# EAGLE schematic BeagleBone_Blue (EAGLE 7.3.0)

## Sheet 1 of 4
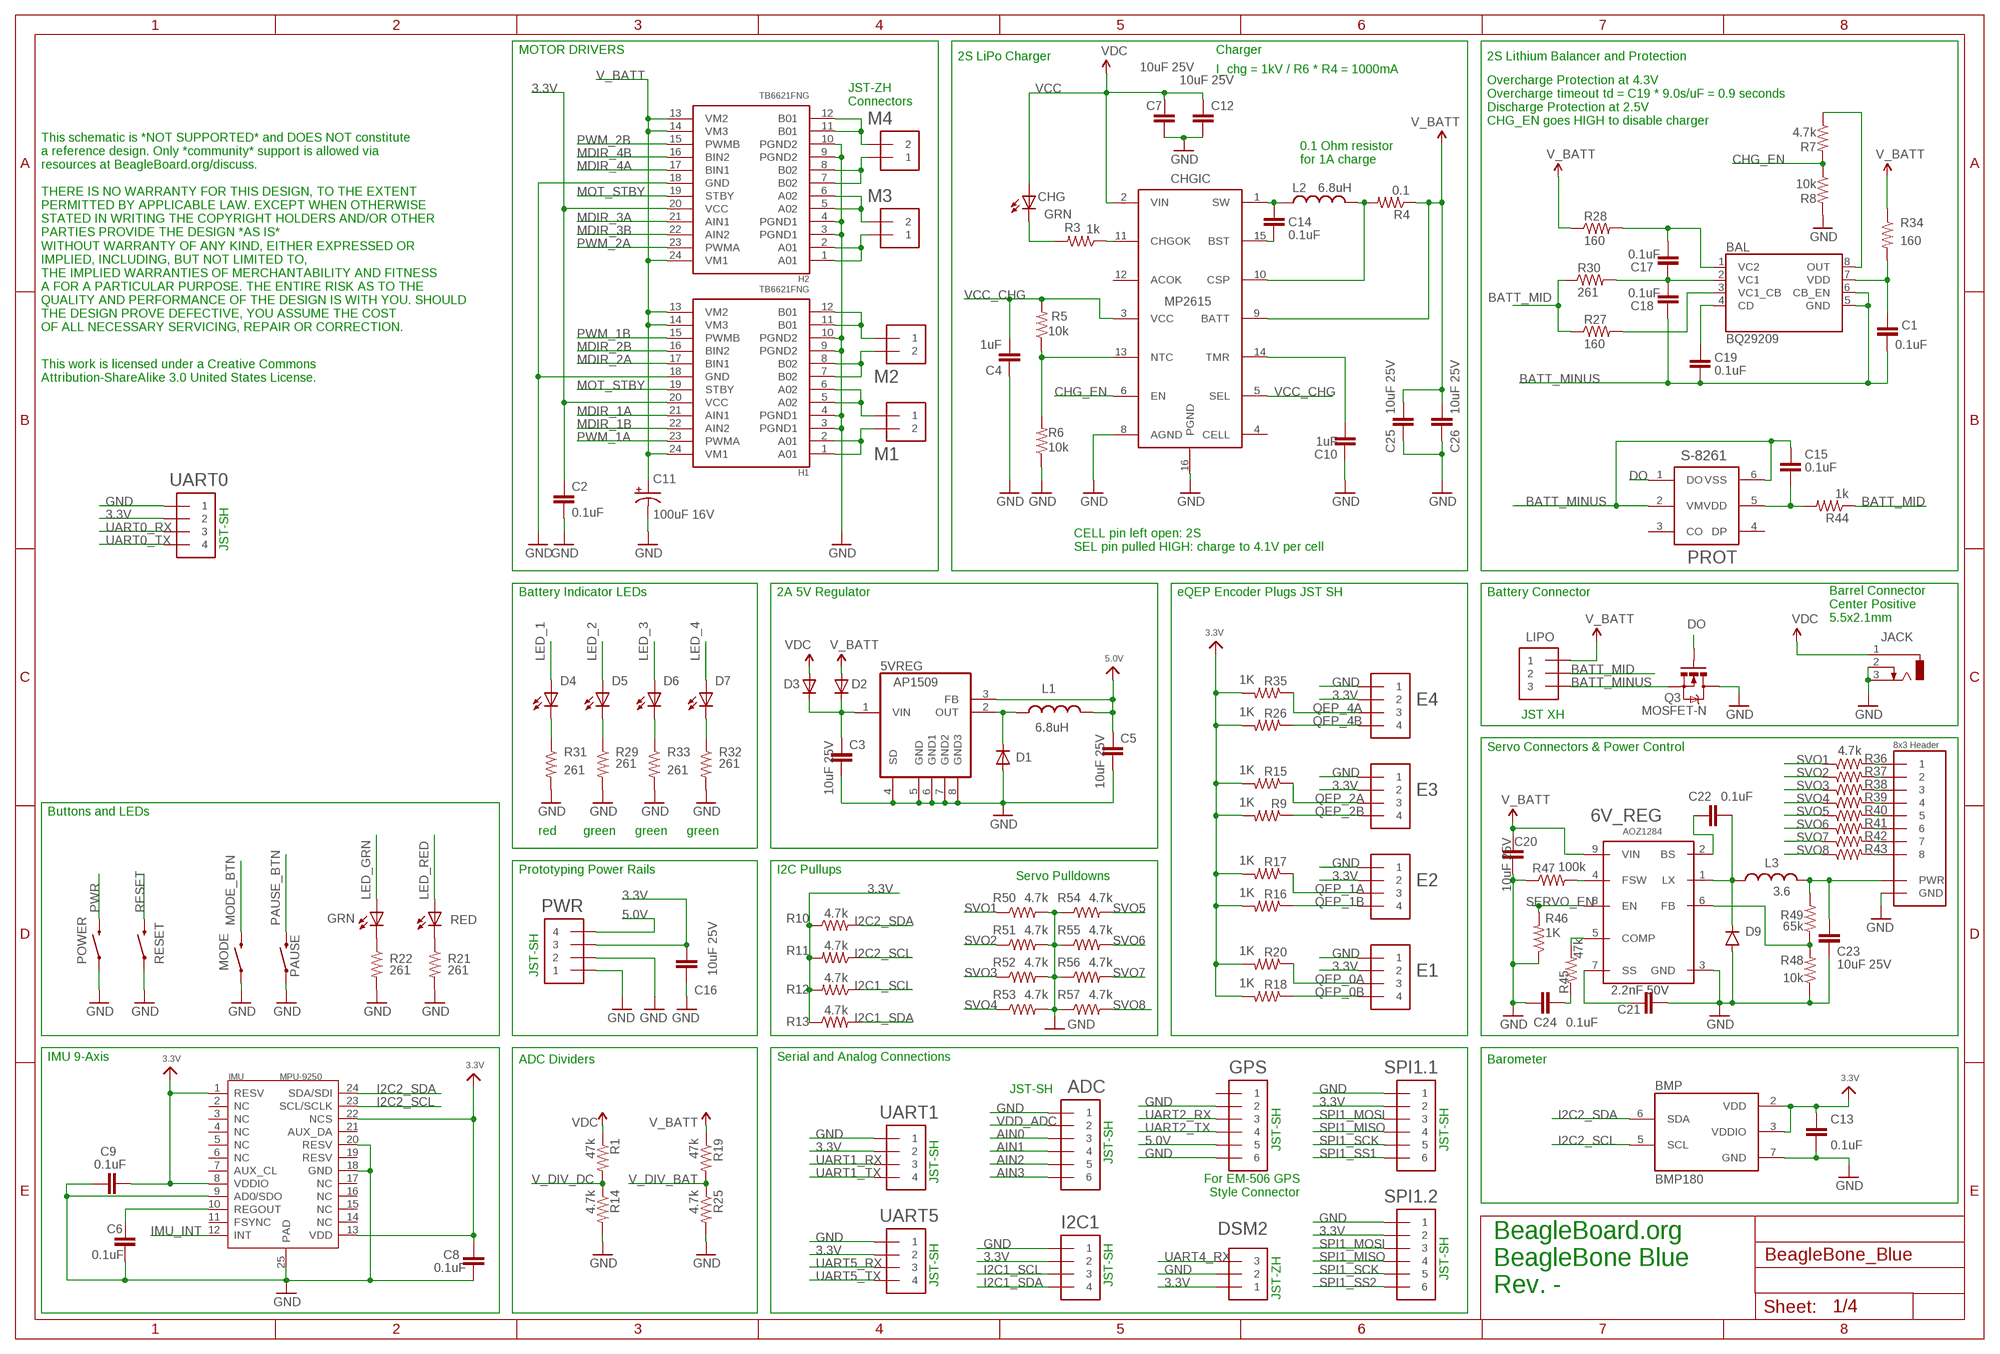
[diagram p0: schematic, sheet 1]

### Parts
5VREG  AP1509SOIC-8-TIGHT  [SO08-TIGHT]
6V_REG  AOZ1284  [SO08-EXPOSED]
ADC  JST_SH_6  [JST_SH_6]
BAL  BQ29209  [8-SON_3X3MM]
BMP  BMP180  [BMP180]
C1  0.1uF  CAP0402-CAP  [0402-CAP]
C2  0.1uF  CAP0402-CAP  [0402-CAP]
C3  10uF 25V  CAP0805  [0805]
C4  1uF  CAP0402-CAP  [0402-CAP]
C5  10uF 25V  CAP0805  [0805]
C6  0.1uF  CAP0402-CAP  [0402-CAP]
C7  10uF 25V  CAP0805  [0805]
C8  0.1uF  CAP0402-CAP  [0402-CAP]
C9  0.1uF  CAP0402-CAP  [0402-CAP]
C10  1uF  CAP0402-CAP  [0402-CAP]
C11  100uF 16V  CPOL-USD  [PANASONIC_D]
C12  10uF 25V  CAP0805  [0805]
C13  0.1uF  CAP0402-CAP  [0402-CAP]
C14  0.1uF  CAP0402-CAP  [0402-CAP]
C15  0.1uF  CAP0402-CAP  [0402-CAP]
C16  10uF 25V  CAP0805  [0805]
C17  0.1uF  CAP0402-CAP  [0402-CAP]
C18  0.1uF  CAP0402-CAP  [0402-CAP]
C19  0.1uF  CAP0402-CAP  [0402-CAP]
C20  10uF 25V  CAP0805  [0805]
C21  2.2nF 50V  CAP0402-CAP  [0402-CAP]
C22  0.1uF  CAP0402-CAP  [0402-CAP]
C23  10uF 25V  CAP0805  [0805]
C24  0.1uF  CAP0402-CAP  [0402-CAP]
C25  10uF 25V  CAP0805  [0805]
C26  10uF 25V  CAP0805  [0805]
CHG  GRN  LED0603  [LED-0603]
CHGIC  MP2615  [MP2615]
D1  DIODESOD-123  [SOD-123]
D2  DIODESOD-123  [SOD-123]
D3  DIODESOD-123  [SOD-123]
D4  RED  LED0603  [LED-0603]
D5  GREEN  LED0603  [LED-0603]
D6  GREEN  LED0603  [LED-0603]
D7  GREEN  LED0603  [LED-0603]
D9  DIODEDO214AA  [DO-214AA]
DSM2  JST_ZH_3SMD_TOP  [JST_ZH_3_SMD_TOP]
E1  JST_SH_4  [JST_SH_4_SMD]
E2  JST_SH_4  [JST_SH_4_SMD]
E3  JST_SH_4  [JST_SH_4_SMD]
E4  JST_SH_4  [JST_SH_4_SMD]
GPS  JST_SH_6  [JST_SH_6]
GRN  GRN  LED0603  [LED-0603]
H1  TB6621FNG  [SSOP24]
H2  TB6621FNG  [SSOP24]
I2C1  JST_SH_4  [JST_SH_4_SMD]
IMU  MPU-9250  [QFN24G-0.4-3X3MM]
JACK  5.5x2.1mm  DCJ0303  [DCJ0303]
L1  6.8uH  INDUCTORBOURNS_SRN6045  [SRN6045]
L2  6.8uH  INDUCTORBOURNS_SRN6045  [SRN6045]
L3  3.6  INDUCTOR  [8X8MM_INDUCTOR]
LIPO  JST_XH_3-PIN  [JST_XH_3-PIN]
M1  JST_ZH_2  [JST_ZH_2]
M2  JST_ZH_2  [JST_ZH_2]
M3  JST_ZH_2  [JST_ZH_2]
M4  JST_ZH_2  [JST_ZH_2]
MODE  SWITCH-MOMENTARY-2SMD-1101NE  [TACTILE-SWITCH-1101NE]
PAUSE  SWITCH-MOMENTARY-2SMD-1101NE  [TACTILE-SWITCH-1101NE]
POWER  SWITCH-MOMENTARY-2SMD-1101NE  [TACTILE-SWITCH-1101NE]
PROT  S-8261  [SOT-236]
PWR  JST_SH_4  [JST_SH_4_SMD]
Q3  MOSFET-N  MOSFET-NCHANNEL  [SO08-TIGHT]
R1  47k  RESISTOR0402-RES  [0402-RES]
R3  1k  RESISTOR0402-RES  [0402-RES]
R4  0.1  RESISTOR0603  [0603-RES]
R5  10k  RESISTOR0402-RES  [0402-RES]
R6  10k  RESISTOR0402-RES  [0402-RES]
R7  4.7k  RESISTOR0402-RES  [0402-RES]
R8  10k  RESISTOR0402-RES  [0402-RES]
R9  1K  RESISTOR0402-RES  [0402-RES]
R10  4.7k  RESISTOR0402-RES  [0402-RES]
R11  4.7k  RESISTOR0402-RES  [0402-RES]
R12  4.7k  RESISTOR0402-RES  [0402-RES]
R13  4.7k  RESISTOR0402-RES  [0402-RES]
R14  4.7k  RESISTOR0402-RES  [0402-RES]
R15  1K  RESISTOR0402-RES  [0402-RES]
R16  1K  RESISTOR0402-RES  [0402-RES]
R17  1K  RESISTOR0402-RES  [0402-RES]
R18  1K  RESISTOR0402-RES  [0402-RES]
R19  47k  RESISTOR0402-RES  [0402-RES]
R20  1K  RESISTOR0402-RES  [0402-RES]
R21  261  RESISTOR0402-RES  [0402-RES]
R22  261  RESISTOR0402-RES  [0402-RES]
R25  4.7k  RESISTOR0402-RES  [0402-RES]
R26  1K  RESISTOR0402-RES  [0402-RES]
R27  160  RESISTOR0402-RES  [0402-RES]
R28  160  RESISTOR0402-RES  [0402-RES]
R29  261  RESISTOR0402-RES  [0402-RES]
R30  261  RESISTOR0402-RES  [0402-RES]
R31  261  RESISTOR0402-RES  [0402-RES]
R32  261  RESISTOR0402-RES  [0402-RES]
R33  261  RESISTOR0402-RES  [0402-RES]
R34  160  RESISTOR0402-RES  [0402-RES]
R35  1K  RESISTOR0402-RES  [0402-RES]
R36  4.7k  RESISTOR0402-RES  [0402-RES]
R37  4.7k  RESISTOR0402-RES  [0402-RES]
R38  4.7k  RESISTOR0402-RES  [0402-RES]
R39  4.7k  RESISTOR0402-RES  [0402-RES]
R40  4.7k  RESISTOR0402-RES  [0402-RES]
R41  4.7k  RESISTOR0402-RES  [0402-RES]
R42  4.7k  RESISTOR0402-RES  [0402-RES]
R43  4.7k  RESISTOR0402-RES  [0402-RES]
R44  1k  RESISTOR0402-RES  [0402-RES]
R45  47k  RESISTOR0402-RES  [0402-RES]
R46  1K  RESISTOR0402-RES  [0402-RES]
R47  100k  RESISTOR0402-RES  [0402-RES]
R48  10k  RESISTOR0402-RES  [0402-RES]
R49  65k  RESISTOR0402-RES  [0402-RES]
R50  4.7k  RESISTOR0402-RES  [0402-RES]
R51  4.7k  RESISTOR0402-RES  [0402-RES]
R52  4.7k  RESISTOR0402-RES  [0402-RES]
R53  4.7k  RESISTOR0402-RES  [0402-RES]
R54  4.7k  RESISTOR0402-RES  [0402-RES]
R55  4.7k  RESISTOR0402-RES  [0402-RES]
R56  4.7k  RESISTOR0402-RES  [0402-RES]
R57  4.7k  RESISTOR0402-RES  [0402-RES]
RED  RED  LED0603  [LED-0603]
RESET  SWITCH-MOMENTARY-2SMD-1101NE  [TACTILE-SWITCH-1101NE]
SPI1.1  JST_SH_6  [JST_SH_6]
SPI1.2  JST_SH_6  [JST_SH_6]
U$1  SERVO_HEADERS_8X  [3X8_0.1"_HEADER]
UART0  JST_SH_4  [JST_SH_4_SMD]
UART1  JST_SH_4  [JST_SH_4_SMD]
UART5  JST_SH_4  [JST_SH_4_SMD]

### Nets
3.3V: BMP.2(VDD) BMP.3(VDDIO) C2.2 C8.1 C9.2 C13.1 C16.1 DSM2.1 E1.2 E2.2 E3.2 E4.2 H1.20(VCC) H2.20(VCC) I2C1.2 IMU.1(RESV) IMU.8(VDDIO) IMU.13(VDD) IMU.22(NCS) PWR.3 R9.2 R10.1 R11.2 R12.2 R13.1 R15.2 R16.2 R17.2 R18.2 R20.2 R26.2 R35.2 SPI1.1.2 SPI1.2.2 UART0.2 UART1.2 UART5.2
5.0V: 5VREG.3(FB) C5.1 GPS.5 L1.2 PWR.4 ; also sheet 2,3
AIN0: ADC.3 ; also sheet 3
AIN1: ADC.4 ; also sheet 3
AIN2: ADC.5 ; also sheet 3
AIN3: ADC.6 ; also sheet 3
BATT_MID: LIPO.P$2 R27.1 R30.1 R44.1
BATT_MINUS: BAL.5(GND) BAL.6(CB_EN) C1.2 C15.1 C18.1 C19.2 LIPO.P$3 PROT.2(VM) PROT.6(VSS) Q3.1(S) Q3.2(S) Q3.3(S)
CHG_EN: CHGIC.6(EN) R7.2 R8.1
CO: BAL.8(OUT) R7.1
DO: PROT.1(DO) Q3.4(G)
GND: 5VREG.4(SD) 5VREG.5(GND) 5VREG.6(GND1) 5VREG.7(GND2) 5VREG.8(GND3) 6V_REG.3(GND) ADC.1 BMP.7(GND) C2.1 C3.2 C4.1 C5.2 C6.2 C7.2 C8.2 C9.1 C10.1 C11.- C12.2 C13.2 C16.2 C20.1 C21.1 C23.1 C24.1 C25.2 C26.2 CHGIC.8(AGND) CHGIC.16(PGND) D1.A D9.A DSM2.2 E1.1 E2.1 E3.1 E4.1 GPS.2 GPS.6 H1.3(PGND1) H1.4(PGND1) H1.9(PGND2) H1.10(PGND2) H1.18(GND) H2.3(PGND1) H2.4(PGND1) H2.9(PGND2) H2.10(PGND2) H2.18(GND) I2C1.1 IMU.9(AD0/SDO) IMU.18(GND) IMU.20(RESV) IMU.25(PAD) JACK.2 JACK.3 MODE.1 PAUSE.1 POWER.1 PWR.1 PWR.2 Q3.5(D) Q3.6(D) Q3.7(D) Q3.8(D) R6.1 R8.2 R14.2 R21.2 R22.2 R25.2 R29.2 R31.2 R32.2 R33.2 R46.1 R47.1 R48.1 R50.2 R51.2 R52.2 R53.2 R54.1 R55.1 R56.1 R57.1 RESET.1 SPI1.1.1 SPI1.2.1 U$1.P$13(GND) U$1.P$14(GND) U$1.P$15(GND) U$1.P$16(GND) U$1.P$17(GND) U$1.P$18(GND) U$1.P$23(GND) U$1.P$24(GND) UART0.1 UART1.1 UART5.1 ; also sheet 2,3,4
I2C1_SCL: I2C1.3 R12.1 ; also sheet 2
I2C1_SDA: I2C1.4 R13.2 ; also sheet 2
I2C2_SCL: BMP.5(SCL) IMU.23(SCL/SCLK) R11.1 ; also sheet 2
I2C2_SDA: BMP.6(SDA) IMU.24(SDA/SDI) R10.2 ; also sheet 2
IMU_INT: IMU.12(INT) ; also sheet 2
L3: D6.C R33.1
L4: D7.C R32.1
LED_1: D4.A ; also sheet 2
LED_2: D5.A ; also sheet 3
LED_3: D6.A ; also sheet 2
LED_4: D7.A ; also sheet 2
LED_GRN: GRN.A ; also sheet 2
LED_RED: RED.A ; also sheet 2
MDIR_1A: H1.21(AIN1) ; also sheet 2
MDIR_1B: H1.22(AIN2) ; also sheet 2
MDIR_2A: H1.17(BIN1) ; also sheet 2
MDIR_2B: H1.16(BIN2) ; also sheet 3
MDIR_3A: H2.21(AIN1) ; also sheet 3
MDIR_3B: H2.22(AIN2) ; also sheet 3
MDIR_4A: H2.17(BIN1) ; also sheet 3
MDIR_4B: H2.16(BIN2) ; also sheet 3
MODE_BTN: MODE.2 ; also sheet 2
MOT1A: H1.1(A01) H1.2(A01) M1.P$2
MOT1B: H1.5(A02) H1.6(A02) M1.P$1
MOT2A: H1.11(B01) H1.12(B01) M2.P$1
MOT2B: H1.7(B02) H1.8(B02) M2.P$2
MOT3A: H2.1(A01) H2.2(A01) M3.P$1
MOT3B: H2.5(A02) H2.6(A02) M3.P$2
MOT4A: H2.11(B01) H2.12(B01) M4.P$2
MOT4B: H2.7(B02) H2.8(B02) M4.P$1
MOT_STBY: H1.19(STBY) H2.19(STBY) ; also sheet 2
N$1: R36.2 U$1.P$1
N$3: GRN.C R22.1
N$4: BAL.2(VC1) C17.1 C18.2 R30.2
N$6: R21.1 RED.C
N$8: BAL.1(VC2) C17.2 R28.2
N$10: 6V_REG.7(SS) C21.2
N$11: C15.2 PROT.5(VDD) R44.2
N$14: C6.1 IMU.10(REGOUT)
N$15: C14.1 CHGIC.15(BST)
N$16: 5VREG.2(OUT) D1.C L1.1
N$17: CHG.C R3.2
N$18: CHGIC.11(CHGOK) R3.1
N$24: BAL.4(CD) C19.1
N$25: R37.2 U$1.P$2
N$29: BAL.7(VDD) C1.1 R34.2
N$30: R38.2 U$1.P$3
N$38: R39.2 U$1.P$4
N$48: D5.C R29.1
N$49: D4.C R31.1
N$50: BAL.3(VC1_CB) R27.2
N$51: R40.2 U$1.P$5
N$52: R41.2 U$1.P$6
N$53: 6V_REG.2(BS) C22.1
N$54: R42.2 U$1.P$19
N$55: C14.2 CHGIC.1(SW) L2.1
N$56: R43.2 U$1.P$20
N$60: 6V_REG.1(LX) C22.2 D9.C L3.1
N$61: 6V_REG.4(FSW) R47.2
N$62: C23.2 L3.2 R49.2 U$1.P$7(PWR) U$1.P$8(PWR) U$1.P$9(PWR) U$1.P$10(PWR) U$1.P$11(PWR) U$1.P$12(PWR) U$1.P$21(PWR) U$1.P$22(PWR)
N$63: 6V_REG.5(COMP) R45.2
N$65: 6V_REG.6(FB) R48.2 R49.1
N$66: C24.2 R45.1
N$67: CHGIC.10(CSP) L2.2 R4.2
N$69: C10.2 CHGIC.14(TMR)
N$71: CHGIC.13(NTC) R5.1 R6.2
N$79: 5VREG.1(VIN) C3.1 D2.C D3.C
PAUSE_BTN: PAUSE.2 ; also sheet 2
PWM_1A: H1.23(PWMA) ; also sheet 2
PWM_1B: H1.15(PWMB) ; also sheet 2
PWM_2A: H2.23(PWMA) ; also sheet 2
PWM_2B: H2.15(PWMB) ; also sheet 2
PWR: POWER.2 ; also sheet 2
QEP_0A: E1.3 R20.1 ; also sheet 2
QEP_0B: E1.4 R18.1 ; also sheet 2
QEP_1A: E2.3 R17.1 ; also sheet 3
QEP_1B: E2.4 R16.1 ; also sheet 3
QEP_2A: E3.3 R15.1 ; also sheet 2
QEP_2B: E3.4 R9.1 ; also sheet 2
QEP_4A: E4.3 R35.1 ; also sheet 2
QEP_4B: E4.4 R26.1 ; also sheet 2
RESET: RESET.2 ; also sheet 2
SERVO_EN: 6V_REG.8(EN) R46.2 ; also sheet 3
SPI1_MISO: SPI1.1.4 SPI1.2.4 ; also sheet 2
SPI1_MOSI: SPI1.1.3 SPI1.2.3 ; also sheet 2
SPI1_SCK: SPI1.1.5 SPI1.2.5 ; also sheet 2
SPI1_SS1: SPI1.1.6 ; also sheet 2
SPI1_SS2: SPI1.2.6 ; also sheet 2
SVO1: R36.1 R50.1 ; also sheet 3
SVO2: R37.1 R51.1 ; also sheet 3
SVO3: R38.1 R52.1 ; also sheet 3
SVO4: R39.1 R53.1 ; also sheet 3
SVO5: R40.1 R54.2 ; also sheet 3
SVO6: R41.1 R55.2 ; also sheet 3
SVO7: R42.1 R56.2 ; also sheet 3
SVO8: R43.1 R57.2 ; also sheet 3
UART0_RX: UART0.3 ; also sheet 2
UART0_TX: UART0.4 ; also sheet 2
UART1_RX: UART1.3 ; also sheet 2
UART1_TX: UART1.4 ; also sheet 2
UART2_RX: GPS.3 ; also sheet 2
UART2_TX: GPS.4 ; also sheet 2
UART4_RX: DSM2.3 ; also sheet 2
UART5_RX: UART5.3 ; also sheet 3
UART5_TX: UART5.4 ; also sheet 3
V_BATT: 6V_REG.9(VIN) C11.+ C20.2 C25.1 C26.1 CHGIC.9(BATT) D2.A H1.13(VM2) H1.14(VM3) H1.24(VM1) H2.13(VM2) H2.14(VM3) H2.24(VM1) LIPO.P$1 R4.1 R19.1 R28.1 R34.1
V_DIV_BAT: R19.2 R25.1 ; also sheet 3
V_DIV_DC: R1.2 R14.1 ; also sheet 3
VCC: C7.1 C12.1 CHG.A CHGIC.2(VIN) D3.A JACK.1 R1.1 ; supply symbol labelled VDC
VCC_CHG: C4.2 CHGIC.3(VCC) CHGIC.5(SEL) R5.2
VDD_ADC: ADC.2 ; also sheet 3,4
Unconnected: CHGIC.4(CELL) CHGIC.12(ACOK) GPS.1 IMU.2(NC) IMU.3(NC) IMU.4(NC) IMU.5(NC) IMU.6(NC) IMU.7(AUX_CL) IMU.11(FSYNC) IMU.14(NC) IMU.15(NC) IMU.16(NC) IMU.17(NC) IMU.19(RESV) IMU.21(AUX_DA) PROT.3(CO) PROT.4(DP)

### Notes on the sheet
- MOTOR DRIVERS | Charger
- 2S LiPo Charger | 2S Lithium Balancer and Protection
- I_chg = 1kV / R6 * R4 = 1000mA
- JST-ZH
  Connectors
- Overcharge Protection at 4.3V
  Overcharge timeout td = C19 * 9.0s/uF = 0.9 seconds
  Discharge Protection at 2.5V
  CHG_EN goes HIGH to disable charger
- 0.1 Ohm resistor
  for 1A charge
- This schematic is *NOT SUPPORTED* and DOES NOT constitute 
  a reference design. Only *community* support is allowed via 
  resources at BeagleBoard.org/discuss. 
  
  THERE IS NO WARRANTY FOR THIS DESIGN, TO THE EXTENT 
  PERMITTED BY APPLICABLE LAW. EXCEPT WHEN OTHERWISE 
  STATED IN WRITING THE COPYRIGHT HOLDERS AND/OR OTHER 
  PARTIES PROVIDE THE DESIGN *AS IS*
  WITHOUT WARRANTY OF ANY KIND, EITHER EXPRESSED OR 
  IMPLIED, INCLUDING, BUT NOT LIMITED TO, 
  THE IMPLIED WARRANTIES OF MERCHANTABILITY AND FITNESS 
  A FOR A PARTICULAR PURPOSE. THE ENTIRE RISK AS TO THE 
  QUALITY AND PERFORMANCE OF THE DESIGN IS WITH YOU. SHOULD 
  THE DESIGN PROVE DEFECTIVE, YOU ASSUME THE COST 
  OF ALL NECESSARY SERVICING, REPAIR OR CORRECTION.
- This work is licensed under a Creative Commons 
  Attribution-ShareAlike 3.0 United States License.
- JST-SH
- CELL pin left open: 2S
  SEL pin pulled HIGH: charge to 4.1V per cell
- Battery Indicator LEDs | 2A 5V Regulator | eQEP Encoder Plugs JST SH | Battery Connector
- Barrel Connector
  Center Positive
  5.5x2.1mm
- JST XH
- Servo Connectors & Power Control
- Buttons and LEDs
- red | green | green | green
- Prototyping Power Rails | I2C Pullups
- Servo Pulldowns
- JST-SH
- ADC Dividers | Barometer
- IMU 9-Axis | Serial and Analog Connections
- JST-SH
- JST-SH | JST-SH
- JST-SH
- JST-SH
- For EM-506 GPS
  Style Connector
- JST-SH
- JST-SH | JST-SH
- BeagleBoard.org
  BeagleBone Blue
  Rev. -
- JST-ZH

## Sheet 2 of 4
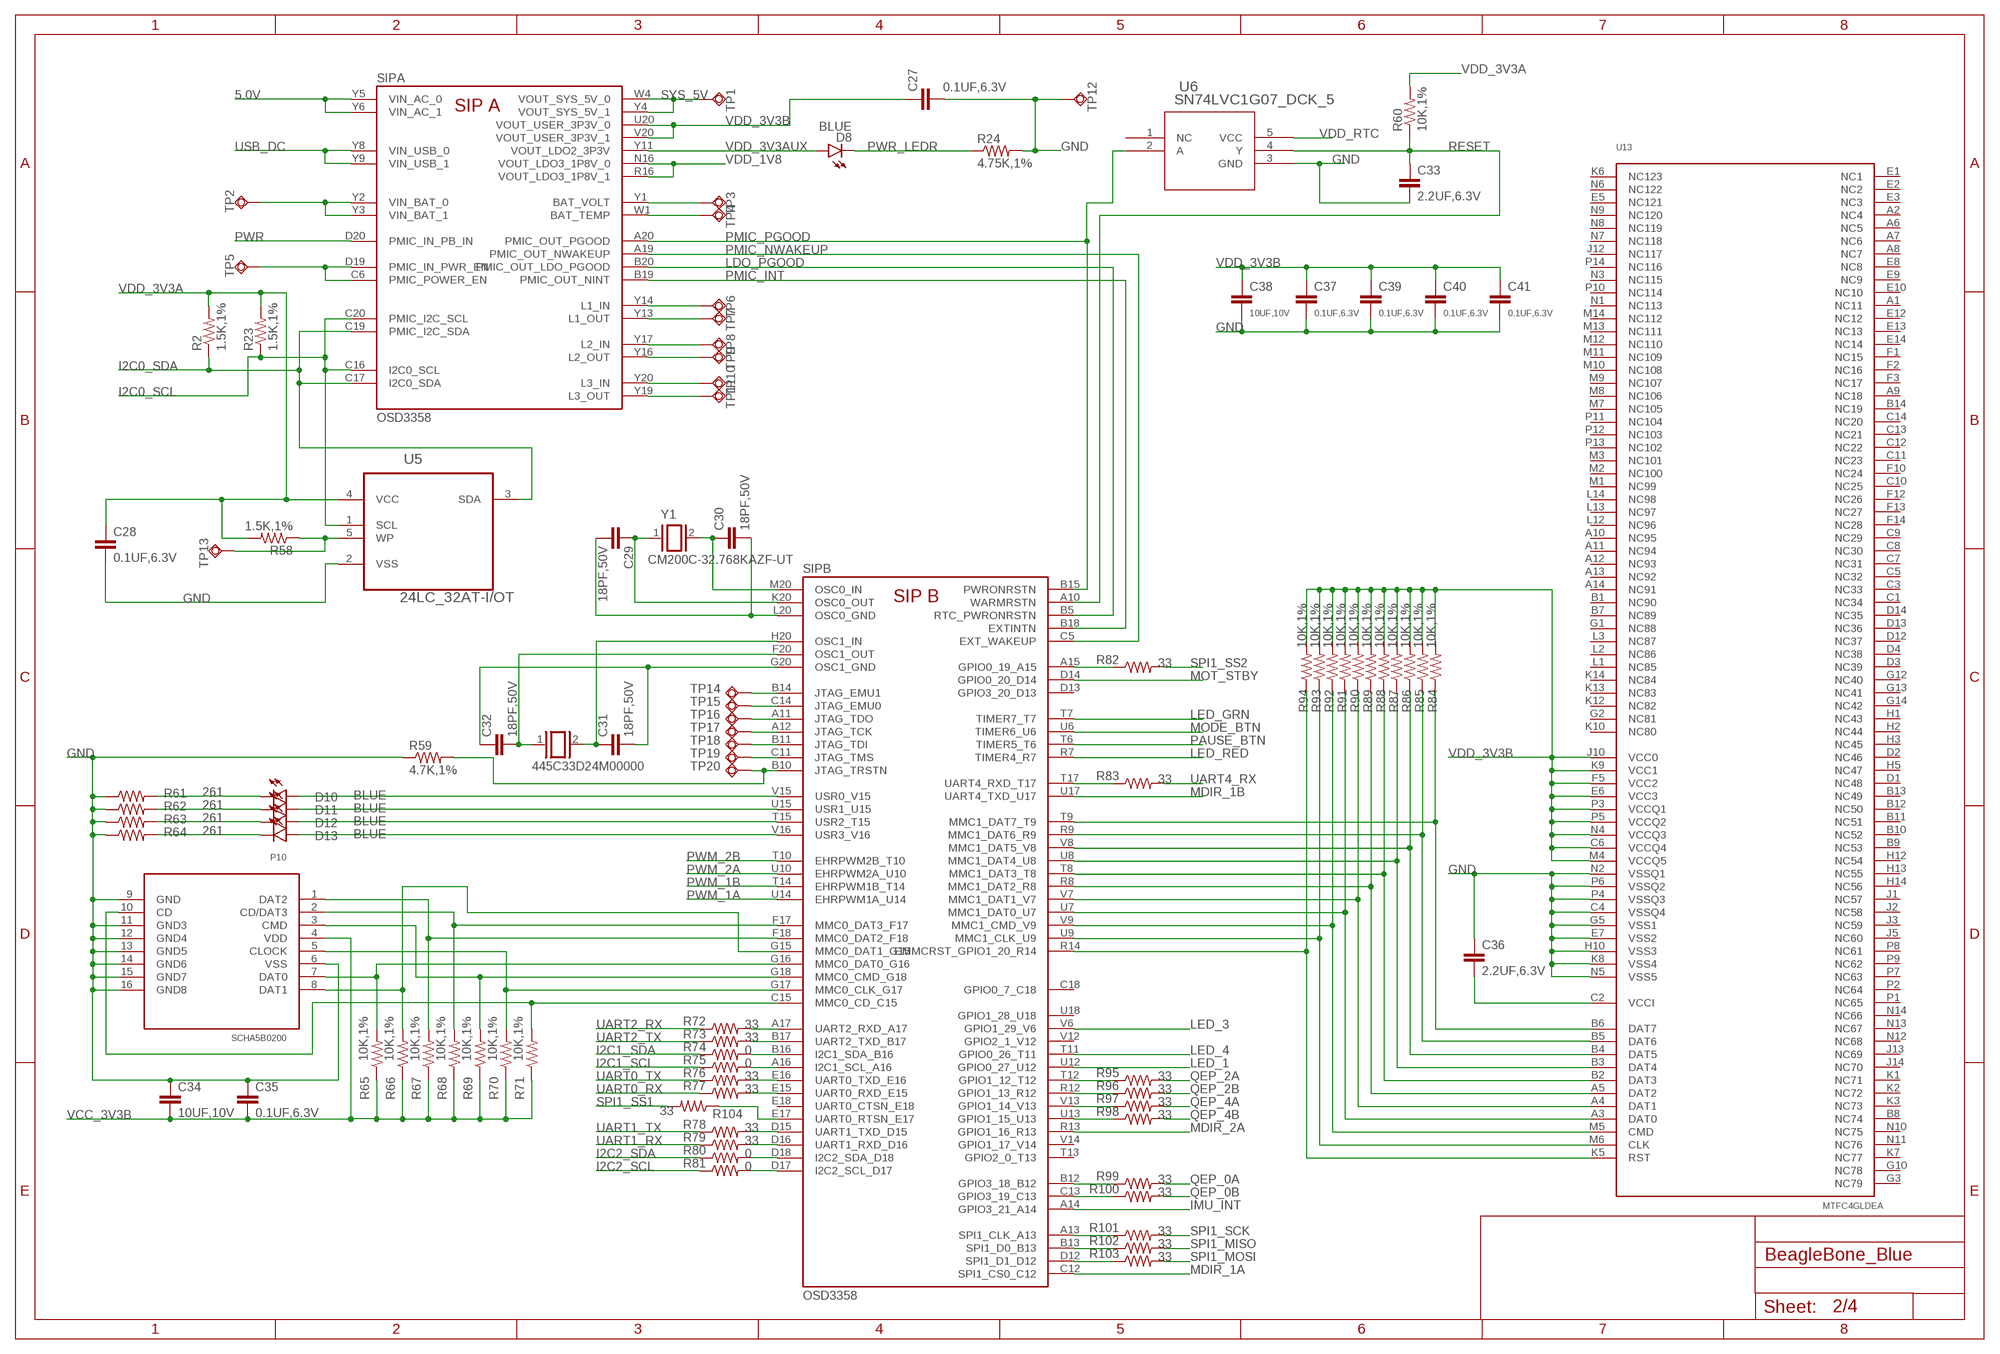
[diagram p1: schematic, sheet 2]

### Parts
C27  0.1UF,6.3V  CAP0402-CAP  [0402-CAP]
C28  0.1UF,6.3V  CAP0402-CAP  [0402-CAP]
C29  18PF,50V  CAP0402-CAP  [0402-CAP]
C30  18PF,50V  CAP0402-CAP  [0402-CAP]
C31  18PF,50V  CAP0402-CAP  [0402-CAP]
C32  18PF,50V  CAP0402-CAP  [0402-CAP]
C33  2.2UF,6.3V  CAP0402-CAP  [0402-CAP]
C34  10UF,10V  CAP0805  [0805]
C35  0.1UF,6.3V  CAP0402-CAP  [0402-CAP]
C36  2.2UF,6.3V  CAP0402-CAP  [0402-CAP]
C37  0.1UF,6.3V  CAP0402-CAP  [0402-CAP]
C38  10UF,10V  CAP0805  [0805]
C39  0.1UF,6.3V  CAP0402-CAP  [0402-CAP]
C40  0.1UF,6.3V  CAP0402-CAP  [0402-CAP]
C41  0.1UF,6.3V  CAP0402-CAP  [0402-CAP]
D8  BLUE  LED0603  [LED-0603]
D10  BLUE  LED0603  [LED-0603]
D11  BLUE  LED0603  [LED-0603]
D12  BLUE  LED0603  [LED-0603]
D13  BLUE  LED0603  [LED-0603]
P10  SCHA5B0200  [SCHA5B0200]
R2  1.5K,1%  RESISTOR0402-RES  [0402-RES]
R23  1.5K,1%  RESISTOR0402-RES  [0402-RES]
R24  4.75K,1%  RESISTOR0402-RES  [0402-RES]
R58  1.5K,1%  RESISTOR0402-RES  [0402-RES]
R59  4.7K,1%  RESISTOR0402-RES  [0402-RES]
R60  10K,1%  RESISTOR0402-RES  [0402-RES]
R61  261  RESISTOR0402-RES  [0402-RES]
R62  261  RESISTOR0402-RES  [0402-RES]
R63  261  RESISTOR0402-RES  [0402-RES]
R64  261  RESISTOR0402-RES  [0402-RES]
R65  10K,1%  RESISTOR0402-RES  [0402-RES]
R66  10K,1%  RESISTOR0402-RES  [0402-RES]
R67  10K,1%  RESISTOR0402-RES  [0402-RES]
R68  10K,1%  RESISTOR0402-RES  [0402-RES]
R69  10K,1%  RESISTOR0402-RES  [0402-RES]
R70  10K,1%  RESISTOR0402-RES  [0402-RES]
R71  10K,1%  RESISTOR0402-RES  [0402-RES]
R72  33  RESISTOR0402-RES  [0402-RES]
R73  33  RESISTOR0402-RES  [0402-RES]
R74  0  RESISTOR0402-RES  [0402-RES]
R75  0  RESISTOR0402-RES  [0402-RES]
R76  33  RESISTOR0402-RES  [0402-RES]
R77  33  RESISTOR0402-RES  [0402-RES]
R78  33  RESISTOR0402-RES  [0402-RES]
R79  33  RESISTOR0402-RES  [0402-RES]
R80  0  RESISTOR0402-RES  [0402-RES]
R81  0  RESISTOR0402-RES  [0402-RES]
R82  33  RESISTOR0402-RES  [0402-RES]
R83  33  RESISTOR0402-RES  [0402-RES]
R84  10K,1%  RESISTOR0402-RES  [0402-RES]
R85  10K,1%  RESISTOR0402-RES  [0402-RES]
R86  10K,1%  RESISTOR0402-RES  [0402-RES]
R87  10K,1%  RESISTOR0402-RES  [0402-RES]
R88  10K,1%  RESISTOR0402-RES  [0402-RES]
R89  10K,1%  RESISTOR0402-RES  [0402-RES]
R90  10K,1%  RESISTOR0402-RES  [0402-RES]
R91  10K,1%  RESISTOR0402-RES  [0402-RES]
R92  10K,1%  RESISTOR0402-RES  [0402-RES]
R93  10K,1%  RESISTOR0402-RES  [0402-RES]
R94  10K,1%  RESISTOR0402-RES  [0402-RES]
R95  33  RESISTOR0402-RES  [0402-RES]
R96  33  RESISTOR0402-RES  [0402-RES]
R97  33  RESISTOR0402-RES  [0402-RES]
R98  33  RESISTOR0402-RES  [0402-RES]
R99  33  RESISTOR0402-RES  [0402-RES]
R100  33  RESISTOR0402-RES  [0402-RES]
R101  33  RESISTOR0402-RES  [0402-RES]
R102  33  RESISTOR0402-RES  [0402-RES]
R103  33  RESISTOR0402-RES  [0402-RES]
R104  33  RESISTOR0402-RES  [0402-RES]
SIP  OSD3358  [OSD3358]
TP1  TPSQB1,27  [B1,27]
TP2  TPSQB1,27  [B1,27]
TP3  TPSQB1,27  [B1,27]
TP4  TPSQB1,27  [B1,27]
TP5  TPSQB1,27  [B1,27]
TP6  TPSQB1,27  [B1,27]
TP7  TPSQB1,27  [B1,27]
TP8  TPSQB1,27  [B1,27]
TP9  TPSQB1,27  [B1,27]
TP10  TPSQB1,27  [B1,27]
TP11  TPSQB1,27  [B1,27]
TP12  TPSQB1,27  [B1,27]
TP13  TPSQB1,27  [B1,27]
TP14  TPSQB1,27  [B1,27]
TP15  TPSQB1,27  [B1,27]
TP16  TPSQB1,27  [B1,27]
TP17  TPSQB1,27  [B1,27]
TP18  TPSQB1,27  [B1,27]
TP19  TPSQB1,27  [B1,27]
TP20  TPSQB1,27  [B1,27]
U5  24LC_32AT-I/OT  [SOT95P290X145-5N]
U6  SN74LVC1G07_DCK_5  [DCK5]
U8  MTFC4GLDEA  [MTFC4GLDEA]
Y1  CM200C-32.768KAZF-UT  [CM200C-32.768KAZF-UT]
Y2  445C33D24M00000  [445C33D24M00000]

### Nets
5.0V: SIP.Y5(A:VIN_AC_0) SIP.Y6(A:VIN_AC_1) ; also sheet 1,3
GND: C27.2 C28.2 C33.2 C34.1 C35.1 C36.1 C37.2 C38.2 C39.2 C40.2 C41.2 P10.6(VSS) P10.9(GND) P10.11(GND3) P10.12(GND4) P10.13(GND5) P10.14(GND6) P10.15(GND7) P10.16(GND8) R24.2 R59.1 R61.1 R62.1 R63.1 R64.1 TP12.TP U5.2(VSS) U6.3(GND) U8.C4(VSSQ4) U8.E7(VSS2) U8.G5(VSS1) U8.H10(VSS3) U8.K8(VSS4) U8.N2(VSSQ1) U8.N5(VSS5) U8.P4(VSSQ3) U8.P6(VSSQ2) ; also sheet 1,3,4
I2C0_SCL: R23.1 SIP.C16(A:I2C0_SCL) SIP.C20(A:PMIC_I2C_SCL) U5.1(SCL)
I2C0_SDA: R2.1 SIP.C17(A:I2C0_SDA) SIP.C19(A:PMIC_I2C_SDA) U5.3(SDA)
I2C1_SCL: R75.1 ; also sheet 1
I2C1_SDA: R74.1 ; also sheet 1
I2C2_SCL: R81.1 ; also sheet 1
I2C2_SDA: R80.1 ; also sheet 1
IMU_INT: SIP.A14(B:GPIO3_21_A14) ; also sheet 1
LDO_PGOOD: SIP.B5(B:RTC_PWRONRSTN) SIP.B20(A:PMIC_OUT_LDO_PGOOD)
LED_1: SIP.U12(B:GPIO0_27_U12) ; also sheet 1
LED_3: SIP.V6(B:GPIO1_29_V6) ; also sheet 1
LED_4: SIP.T11(B:GPIO0_26_T11) ; also sheet 1
LED_GRN: SIP.T7(B:TIMER7_T7) ; also sheet 1
LED_RED: SIP.R7(B:TIMER4_R7) ; also sheet 1
MDIR_1A: SIP.C12(B:SPI1_CS0_C12) ; also sheet 1
MDIR_1B: SIP.U17(B:UART4_TXD_U17) ; also sheet 1
MDIR_2A: SIP.R13(B:GPIO1_16_R13) ; also sheet 1
MODE_BTN: SIP.U6(B:TIMER6_U6) ; also sheet 1
MOT_STBY: SIP.D14(B:GPIO0_20_D14) ; also sheet 1
N$5: SIP.Y2(A:VIN_BAT_0) SIP.Y3(A:VIN_BAT_1) TP2.TP
N$7: SIP.Y1(A:BAT_VOLT) TP3.TP
N$9: SIP.W1(A:BAT_TEMP) TP4.TP
N$12: SIP.C6(A:PMIC_POWER_EN) SIP.D19(A:PMIC_IN_PWR_EN) TP5.TP
N$13: SIP.Y14(A:L1_IN) TP6.TP
N$19: SIP.Y13(A:L1_OUT) TP7.TP
N$20: SIP.Y17(A:L2_IN) TP8.TP
N$21: SIP.Y16(A:L2_OUT) TP9.TP
N$22: SIP.Y20(A:L3_IN) TP10.TP
N$23: SIP.Y19(A:L3_OUT) TP11.TP
N$26: C30.1 SIP.M20(B:OSC0_IN) Y1.2
N$27: C29.1 SIP.K20(B:OSC0_OUT) Y1.1
N$28: R58.1 TP13.TP U5.5(WP)
N$31: C29.2 C30.2 SIP.L20(B:OSC0_GND)
N$32: C31.1 SIP.H20(B:OSC1_IN) Y2.2
N$33: C32.2 SIP.F20(B:OSC1_OUT) Y2.1
N$34: C31.2 C32.1 SIP.G20(B:OSC1_GND)
N$35: SIP.B14(B:JTAG_EMU1) TP14.TP
N$36: SIP.C14(B:JTAG_EMU0) TP15.TP
N$37: SIP.A11(B:JTAG_TDO) TP16.TP
N$39: SIP.A12(B:JTAG_TCK) TP17.TP
N$40: SIP.B11(B:JTAG_TDI) TP18.TP
N$41: SIP.C11(B:JTAG_TMS) TP19.TP
N$42: R59.2 SIP.B10(B:JTAG_TRSTN) TP20.TP
N$43: D13.A SIP.V16(B:USR3_V16)
N$44: D12.A SIP.T15(B:USR2_T15)
N$45: D11.A SIP.U15(B:USR1_U15)
N$46: D10.A SIP.V15(B:USR0_V15)
N$47: D10.C R61.2
N$57: D11.C R62.2
N$58: D12.C R63.2
N$59: D13.C R64.2
N$64: P10.2(CD/DAT3) R68.2 SIP.F17(B:MMC0_DAT3_F17)
N$68: R72.2 SIP.A17(B:UART2_RXD_A17)
N$70: P10.8(DAT1) R66.2 SIP.G15(B:MMC0_DAT1_G15)
N$72: R73.2 SIP.B17(B:UART2_TXD_B17)
N$73: P10.5(CLOCK) R70.2 SIP.G17(B:MMC0_CLK_G17)
N$74: P10.3(CMD) R69.2 SIP.G18(B:MMC0_CMD_G18)
N$75: P10.10(CD) R71.2 SIP.C15(B:MMC0_CD_C15)
N$76: R74.2 SIP.B16(B:I2C1_SDA_B16)
N$77: P10.7(DAT0) R65.2 SIP.G16(B:MMC0_DAT0_G16)
N$78: R75.2 SIP.A16(B:I2C1_SCL_A16)
N$80: R76.2 SIP.E16(B:UART0_TXD_E16)
N$81: R77.2 SIP.E15(B:UART0_RXD_E15)
N$82: R78.2 SIP.D15(B:UART1_TXD_D15)
N$83: R79.2 SIP.D16(B:UART1_RXD_D16)
N$84: R80.2 SIP.D18(B:I2C2_SDA_D18)
N$85: R81.2 SIP.D17(B:I2C2_SCL_D17)
N$86: R82.1 SIP.A15(B:GPIO0_19_A15)
N$87: R83.1 SIP.T17(B:UART4_RXD_T17)
N$88: R84.1 SIP.T9(B:MMC1_DAT7_T9) U8.B6(DAT7)
N$89: R85.1 SIP.R9(B:MMC1_DAT6_R9) U8.B5(DAT6)
N$90: R86.1 SIP.V8(B:MMC1_DAT5_V8) U8.B4(DAT5)
N$91: R87.1 SIP.U8(B:MMC1_DAT4_U8) U8.B3(DAT4)
N$92: R88.1 SIP.T8(B:MMC1_DAT3_T8) U8.B2(DAT3)
N$93: R89.1 SIP.R8(B:MMC1_DAT2_R8) U8.A5(DAT2)
N$94: R90.1 SIP.V7(B:MMC1_DAT1_V7) U8.A4(DAT1)
N$95: R91.1 SIP.U7(B:MMC1_DAT0_U7) U8.A3(DAT0)
N$96: R92.1 SIP.V9(B:MMC1_CMD_V9) U8.M5(CMD)
N$97: R93.1 SIP.U9(B:MMC1_CLK_U9) U8.M6(CLK)
N$98: R94.1 SIP.R14(B:EMMCRST_GPIO1_20_R14) U8.K5(RST)
N$99: R95.1 SIP.T12(B:GPIO1_12_T12)
N$100: R96.1 SIP.R12(B:GPIO1_13_R12)
N$101: R97.1 SIP.V13(B:GPIO1_14_V13)
N$102: R98.1 SIP.U13(B:GPIO1_15_U13)
N$103: R99.1 SIP.B12(B:GPIO3_18_B12)
N$104: R100.1 SIP.C13(B:GPIO3_19_C13)
N$105: R101.1 SIP.A13(B:SPI1_CLK_A13)
N$106: R102.1 SIP.B13(B:SPI1_D0_B13)
N$107: R103.1 SIP.D12(B:SPI1_D1_D12)
N$108: R104.1 SIP.E17(B:UART0_RTSN_E17)
N$109: C36.2 U8.C2(VCCI)
NTE: P10.1(DAT2) R67.2 SIP.F18(B:MMC0_DAT2_F18)
PAUSE_BTN: SIP.T6(B:TIMER5_T6) ; also sheet 1
PMIC_INT: SIP.B18(B:EXTINTN) SIP.B19(A:PMIC_OUT_NINT)
PMIC_NWAKEUP: SIP.A19(A:PMIC_OUT_NWAKEUP) SIP.C5(B:EXT_WAKEUP)
PMIC_PGOOD: SIP.A20(A:PMIC_OUT_PGOOD) SIP.B15(B:PWRONRSTN) U6.2(A)
PWM_1A: SIP.U14(B:EHRPWM1A_U14) ; also sheet 1
PWM_1B: SIP.T14(B:EHRPWM1B_T14) ; also sheet 1
PWM_2A: SIP.U10(B:EHRPWM2A_U10) ; also sheet 1
PWM_2B: SIP.T10(B:EHRPWM2B_T10) ; also sheet 1
PWR: SIP.D20(A:PMIC_IN_PB_IN) ; also sheet 1
PWR_LEDR: D8.C R24.1
QEP_0A: R99.2 ; also sheet 1
QEP_0B: R100.2 ; also sheet 1
QEP_2A: R95.2 ; also sheet 1
QEP_2B: R96.2 ; also sheet 1
QEP_4A: R97.2 ; also sheet 1
QEP_4B: R98.2 ; also sheet 1
RESET: C33.1 R60.1 SIP.A10(B:WARMRSTN) U6.4(Y) ; also sheet 1
SPI1_MISO: R102.2 ; also sheet 1
SPI1_MOSI: R103.2 ; also sheet 1
SPI1_SCK: R101.2 ; also sheet 1
SPI1_SS1: R104.2 ; also sheet 1
SPI1_SS2: R82.2 ; also sheet 1
SYS_5V: SIP.W4(A:VOUT_SYS_5V_0) SIP.Y4(A:VOUT_SYS_5V_1) TP1.TP ; also sheet 3
UART0_RX: R77.1 ; also sheet 1
UART0_TX: R76.1 ; also sheet 1
UART1_RX: R79.1 ; also sheet 1
UART1_TX: R78.1 ; also sheet 1
UART2_RX: R72.1 ; also sheet 1
UART2_TX: R73.1 ; also sheet 1
UART4_RX: R83.2 ; also sheet 1
USB_DC: SIP.Y8(A:VIN_USB_0) SIP.Y9(A:VIN_USB_1) ; also sheet 3
VCC_3V3B: C34.2 C35.2 P10.4(VDD) R65.1 R66.1 R67.1 R68.1 R69.1 R70.1 R71.1
VDD_1V8: SIP.N16(A:VOUT_LDO3_1P8V_0) SIP.R16(A:VOUT_LDO3_1P8V_1) ; also sheet 4
VDD_3V3A: C28.1 R2.2 R23.2 R58.2 R60.2 U5.4(VCC) ; also sheet 3,4
VDD_3V3AUX: D8.A SIP.Y11(A:VOUT_LDO2_3P3V)
VDD_3V3B: C27.1 C37.1 C38.1 C39.1 C40.1 C41.1 R84.2 R85.2 R86.2 R87.2 R88.2 R89.2 R90.2 R91.2 R92.2 R93.2 R94.2 SIP.U20(A:VOUT_USER_3P3V_0) SIP.V20(A:VOUT_USER_3P3V_1) U8.C6(VCCQ4) U8.E6(VCC3) U8.F5(VCC2) U8.J10(VCC0) U8.K9(VCC1) U8.M4(VCCQ5) U8.N4(VCCQ3) U8.P3(VCCQ1) U8.P5(VCCQ2) ; also sheet 3
VDD_RTC: U6.5(VCC) ; also sheet 4
Unconnected: SIP.B1(D:NC4) SIP.B2(D:NC5) SIP.B3(D:NC6) SIP.C1(D:NC12) SIP.C2(D:NC20) SIP.C3(D:NC21) SIP.C4(D:NC22) SIP.C18(B:GPIO0_7_C18) SIP.D1(D:NC24) SIP.D2(D:NC31) SIP.D3(D:NC32) SIP.D4(D:NC33) SIP.D5(D:NC34) SIP.D13(B:GPIO3_20_D13) SIP.E1(D:NC46) SIP.E2(D:NC47) SIP.E3(D:NC48) SIP.E4(D:NC58) SIP.E18(B:UART0_CTSN_E18) SIP.F1(D:NC59) SIP.F2(D:NC60) SIP.F3(D:NC61) SIP.F4(D:NC68) SIP.G1(D:NC69) SIP.G2(D:NC70) SIP.G3(D:NC71) SIP.G4(D:NC76) SIP.H1(D:NC77) SIP.H2(D:NC78) SIP.H3(D:NC79) SIP.H4(D:NC84) SIP.J1(D:NC85) SIP.J2(D:NC86) SIP.J3(D:NC87) SIP.J4(D:NC94) SIP.K1(D:NC95) SIP.K2(D:NC96) SIP.K3(D:NC97) SIP.K4(D:NC104) SIP.L1(D:NC105) SIP.L2(D:NC106) SIP.L3(D:NC107) SIP.L4(D:NC111) SIP.M1(D:NC112) SIP.M2(D:NC113) SIP.M3(D:NC114) SIP.M4(D:NC121) SIP.N1(D:NC123) SIP.N2(D:NC124) SIP.N3(D:NC136) SIP.N4(D:NC137) SIP.P1(D:NC138) SIP.P2(D:NC23) SIP.P3(D:NC45) SIP.P4(D:NC122) SIP.T13(B:GPIO2_0_T13) SIP.U11(D:NC2) SIP.U18(B:GPIO1_28_U18) SIP.V10(D:NC3) SIP.V11(D:NC1) SIP.V12(B:GPIO2_1_V12) SIP.V14(B:GPIO1_17_V14) U6.1(NC) U8.A1(NC11) U8.A2(NC4) U8.A6(NC5) U8.A7(NC6) U8.A8(NC7) U8.A9(NC18) U8.A10(NC95) U8.A11(NC94) U8.A12(NC93) U8.A13(NC92) U8.A14(NC91) U8.B1(NC90) U8.B7(NC89) U8.B8(NC74) U8.B9(NC53) U8.B10(NC52) U8.B11(NC51) U8.B12(NC50) U8.B13(NC49) U8.B14(NC19) U8.C1(NC34) U8.C3(NC33) U8.C5(NC32) U8.C7(NC31) U8.C8(NC30) U8.C9(NC29) U8.C10(NC25) U8.C11(NC23) U8.C12(NC22) U8.C13(NC21) U8.C14(NC20) U8.D1(NC48) U8.D2(NC46) U8.D3(NC39) U8.D4(NC38) U8.D12(NC37) U8.D13(NC36) U8.D14(NC35) U8.E1(NC1) U8.E2(NC2) U8.E3(NC3) U8.E5(NC121) U8.E8(NC8) U8.E9(NC9) U8.E10(NC10) U8.E12(NC12) U8.E13(NC13) U8.E14(NC14) U8.F1(NC15) U8.F2(NC16) U8.F3(NC17) U8.F10(NC24) U8.F12(NC26) U8.F13(NC27) U8.F14(NC28) U8.G1(NC88) U8.G2(NC81) U8.G3(NC79) U8.G10(NC78) U8.G12(NC40) U8.G13(NC41) U8.G14(NC42) U8.H1(NC43) U8.H2(NC44) U8.H3(NC45) U8.H5(NC47) U8.H12(NC54) U8.H13(NC55) U8.H14(NC56) U8.J1(NC57) U8.J2(NC58) U8.J3(NC59) U8.J5(NC60) U8.J12(NC117) U8.J13(NC69) U8.J14(NC70) U8.K1(NC71) U8.K2(NC72) U8.K3(NC73) U8.K6(NC123) U8.K7(NC77) U8.K10(NC80) U8.K12(NC82) U8.K13(NC83) U8.K14(NC84) U8.L1(NC85) U8.L2(NC86) U8.L3(NC87) U8.L12(NC96) U8.L13(NC97) U8.L14(NC98) U8.M1(NC99) U8.M2(NC100) U8.M3(NC101) U8.M7(NC105) U8.M8(NC106) U8.M9(NC107) U8.M10(NC108) U8.M11(NC109) U8.M12(NC110) U8.M13(NC111) U8.M14(NC112) U8.N1(NC113) U8.N3(NC115) U8.N6(NC122) U8.N7(NC118) U8.N8(NC119) U8.N9(NC120) U8.N10(NC75) U8.N11(NC76) U8.N12(NC68) U8.N13(NC67) U8.N14(NC66) U8.P1(NC65) U8.P2(NC64) U8.P7(NC63) U8.P8(NC61) U8.P9(NC62) U8.P10(NC114) U8.P11(NC104) U8.P12(NC103) U8.P13(NC102) U8.P14(NC116)

## Sheet 3 of 4
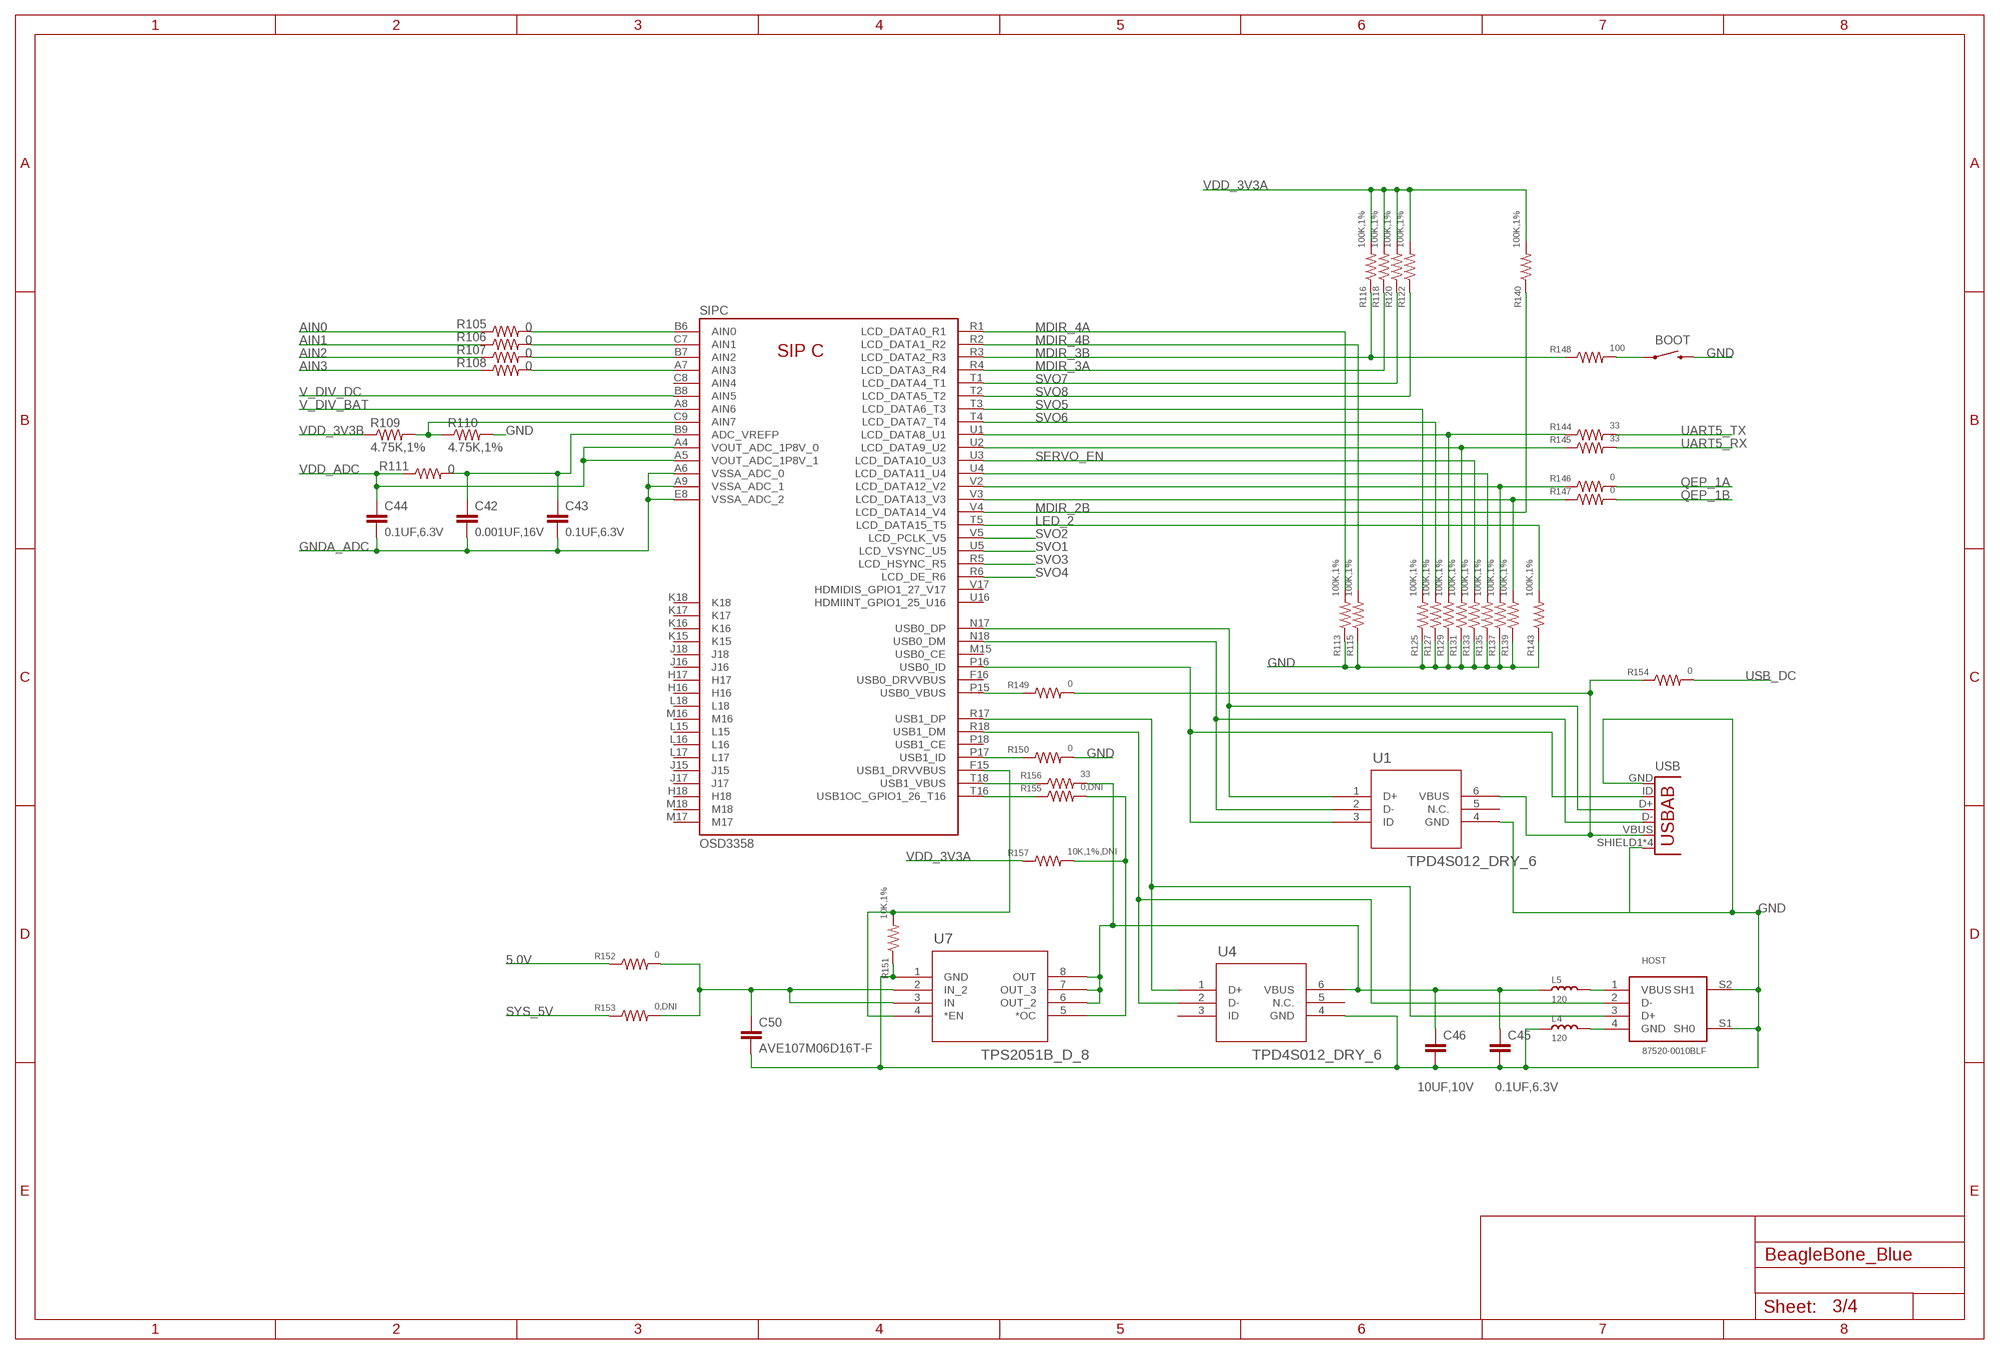
[diagram p2: schematic, sheet 3]

### Parts
BOOT  SWITCH-MOMENTARY-2SMD-1101NE  [TACTILE-SWITCH-1101NE]
C42  0.001UF,16V  CAP0402-CAP  [0402-CAP]
C43  0.1UF,6.3V  CAP0402-CAP  [0402-CAP]
C44  0.1UF,6.3V  CAP0402-CAP  [0402-CAP]
C45  0.1UF,6.3V  CAP0402-CAP  [0402-CAP]
C46  10UF,10V  CAP0805  [0805]
C50  AVE107M06D16T-F  [AVE107M06D16T-F]
HOST  87520-0010BLF  [87520-0010BLF]
L4  120  INDUCTOR/FERRITE-BEAD'0603'  [L0603]
L5  120  INDUCTOR/FERRITE-BEAD'0603'  [L0603]
R105  0  RESISTOR0402-RES  [0402-RES]
R106  0  RESISTOR0402-RES  [0402-RES]
R107  0  RESISTOR0402-RES  [0402-RES]
R108  0  RESISTOR0402-RES  [0402-RES]
R109  4.75K,1%  RESISTOR0402-RES  [0402-RES]
R110  4.75K,1%  RESISTOR0402-RES  [0402-RES]
R111  0  RESISTOR0402-RES  [0402-RES]
R113  100K,1%  RESISTOR0402-RES  [0402-RES]
R115  100K,1%  RESISTOR0402-RES  [0402-RES]
R116  100K,1%  RESISTOR0402-RES  [0402-RES]
R118  100K,1%  RESISTOR0402-RES  [0402-RES]
R120  100K,1%  RESISTOR0402-RES  [0402-RES]
R122  100K,1%  RESISTOR0402-RES  [0402-RES]
R125  100K,1%  RESISTOR0402-RES  [0402-RES]
R127  100K,1%  RESISTOR0402-RES  [0402-RES]
R129  100K,1%  RESISTOR0402-RES  [0402-RES]
R131  100K,1%  RESISTOR0402-RES  [0402-RES]
R133  100K,1%  RESISTOR0402-RES  [0402-RES]
R135  100K,1%  RESISTOR0402-RES  [0402-RES]
R137  100K,1%  RESISTOR0402-RES  [0402-RES]
R139  100K,1%  RESISTOR0402-RES  [0402-RES]
R140  100K,1%  RESISTOR0402-RES  [0402-RES]
R143  100K,1%  RESISTOR0402-RES  [0402-RES]
R144  33  RESISTOR0402-RES  [0402-RES]
R145  33  RESISTOR0402-RES  [0402-RES]
R146  0  RESISTOR0402-RES  [0402-RES]
R147  0  RESISTOR0402-RES  [0402-RES]
R148  100  RESISTOR0402-RES  [0402-RES]
R149  0  RESISTOR0402-RES  [0402-RES]
R150  0  RESISTOR0402-RES  [0402-RES]
R151  10K,1%  RESISTOR0402-RES  [0402-RES]
R152  0  RESISTOR0402-RES  [0402-RES]
R153  0,DNI  RESISTOR0402-RES  [0402-RES]
R154  0  RESISTOR0402-RES  [0402-RES]
R155  0,DNI  RESISTOR0402-RES  [0402-RES]
R156  33  RESISTOR0402-RES  [0402-RES]
R157  10K,1%,DNI  RESISTOR0402-RES  [0402-RES]
U1  TPD4S012_DRY_6  [DRY6]
U4  TPD4S012_DRY_6  [DRY6]
U7  TPS2051B_D_8  [D8]
USB  USB-AB  [USB-AB-MICRO-SMD]

### Nets
5.0V: R152.1 ; also sheet 1,2
AIN0: R105.1 ; also sheet 1
AIN1: R106.1 ; also sheet 1
AIN2: R107.1 ; also sheet 1
AIN3: R108.1 ; also sheet 1
GND: BOOT.2 C45.2 C46.2 C50.- HOST.S1(SH0) HOST.S2(SH1) L4.1 R110.2 R113.1 R115.1 R125.1 R127.1 R129.1 R131.1 R133.1 R135.1 R137.1 R139.1 R143.1 R150.2 R151.1 U1.4(GND) U4.4(GND) U7.1(GND) USB.GND USB.SHIELD1(SHIELD) USB.SHIELD2(SHIELD) USB.SHIELD3(SHIELD) USB.SHIELD4(SHIELD) ; also sheet 1,2,4
GNDA_ADC: C42.2 C43.2 C44.2 SIP.A6(C:VSSA_ADC_0) SIP.A9(C:VSSA_ADC_1) SIP.E8(C:VSSA_ADC_2)
LED_2: R143.2 SIP.T5(C:LCD_DATA15_T5) ; also sheet 1
MDIR_2B: R140.1 SIP.V4(C:LCD_DATA14_V4) ; also sheet 1
MDIR_3A: R118.1 SIP.R4(C:LCD_DATA3_R4) ; also sheet 1
MDIR_3B: R116.1 R148.1 SIP.R3(C:LCD_DATA2_R3) ; also sheet 1
MDIR_4A: R113.2 SIP.R1(C:LCD_DATA0_R1) ; also sheet 1
MDIR_4B: R115.2 SIP.R2(C:LCD_DATA1_R2) ; also sheet 1
N$2: R155.1 SIP.T16(C:USB1OC_GPIO1_26_T16)
N$110: C42.1 C43.1 R111.2 SIP.B9(C:ADC_VREFP)
N$111: R105.2 SIP.B6(C:AIN0)
N$112: R106.2 SIP.C7(C:AIN1)
N$113: R107.2 SIP.B7(C:AIN2)
N$114: R108.2 SIP.A7(C:AIN3)
N$115: R109.2 R110.1 SIP.C9(C:AIN7)
N$116: BOOT.1 R148.2
N$117: SIP.N17(C:USB0_DP) U1.1(D+) USB.D+
N$118: SIP.N18(C:USB0_DM) U1.2(D-) USB.D-
N$119: SIP.P16(C:USB0_ID) U1.3(ID) USB.ID(USBID)
N$120: R151.2 SIP.F15(C:USB1_DRVVBUS) U7.4(*EN)
N$121: R149.1 SIP.P15(C:USB0_VBUS)
N$122: C45.1 C46.1 L5.1 R156.2 U4.6(VBUS) U7.6(OUT_2) U7.7(OUT_3) U7.8(OUT)
N$123: HOST.3(D+) SIP.R17(C:USB1_DP) U4.1(D+)
N$124: HOST.2(D-) SIP.R18(C:USB1_DM) U4.2(D-)
N$125: R155.2 R157.2 U7.5(*OC)
N$126: R150.1 SIP.P17(C:USB1_ID)
N$127: C50.+ R152.2 R153.2 U7.2(IN_2) U7.3(IN)
N$128: HOST.4(GND) L4.2
N$129: R156.1 SIP.T18(C:USB1_VBUS)
N$130: HOST.1(VBUS) L5.2
N$141: R129.2 R144.1 SIP.U1(C:LCD_DATA8_U1)
N$144: R131.2 R145.1 SIP.U2(C:LCD_DATA9_U2)
N$150: R135.2 SIP.U4(C:LCD_DATA11_U4)
N$153: R137.2 R146.1 SIP.V2(C:LCD_DATA12_V2)
N$156: R139.2 R147.1 SIP.V3(C:LCD_DATA13_V3)
QEP_1A: R146.2 ; also sheet 1
QEP_1B: R147.2 ; also sheet 1
SERVO_EN: R133.2 SIP.U3(C:LCD_DATA10_U3) ; also sheet 1
SVO1: SIP.U5(C:LCD_VSYNC_U5) ; also sheet 1
SVO2: SIP.V5(C:LCD_PCLK_V5) ; also sheet 1
SVO3: SIP.R5(C:LCD_HSYNC_R5) ; also sheet 1
SVO4: SIP.R6(C:LCD_DE_R6) ; also sheet 1
SVO5: R125.2 SIP.T3(C:LCD_DATA6_T3) ; also sheet 1
SVO6: R127.2 SIP.T4(C:LCD_DATA7_T4) ; also sheet 1
SVO7: R120.1 SIP.T1(C:LCD_DATA4_T1) ; also sheet 1
SVO8: R122.1 SIP.T2(C:LCD_DATA5_T2) ; also sheet 1
SYS_5V: R153.1 ; also sheet 2
UART5_RX: R145.2 ; also sheet 1
UART5_TX: R144.2 ; also sheet 1
USB0_VBUS: R149.2 R154.1 U1.6(VBUS) USB.VBUS
USB_DC: R154.2 ; also sheet 2
V_DIV_BAT: SIP.A8(C:AIN6) ; also sheet 1
V_DIV_DC: SIP.B8(C:AIN5) ; also sheet 1
VDD_3V3A: R116.2 R118.2 R120.2 R122.2 R140.2 R157.1 ; also sheet 2,4
VDD_3V3B: R109.1 ; also sheet 2
VDD_ADC: C44.1 R111.1 SIP.A4(C:VOUT_ADC_1P8V_0) SIP.A5(C:VOUT_ADC_1P8V_1) ; also sheet 1,4
Unconnected: SIP.C8(C:AIN4) SIP.F16(C:USB0_DRVVBUS) SIP.H16(C:H16) SIP.H17(C:H17) SIP.H18(C:H18) SIP.J15(C:J15) SIP.J16(C:J16) SIP.J17(C:J17) SIP.J18(C:J18) SIP.K15(C:K15) SIP.K16(C:K16) SIP.K17(C:K17) SIP.K18(C:K18) SIP.L15(C:L15) SIP.L16(C:L16) SIP.L17(C:L17) SIP.L18(C:L18) SIP.M15(C:USB0_CE) SIP.M16(C:M16) SIP.M17(C:M17) SIP.M18(C:M18) SIP.P18(C:USB1_CE) SIP.U16(C:HDMIINT_GPIO1_25_U16) SIP.V17(C:HDMIDIS_GPIO1_27_V17) U1.5(N.C.) U4.3(ID) U4.5(N.C.)

## Sheet 4 of 4
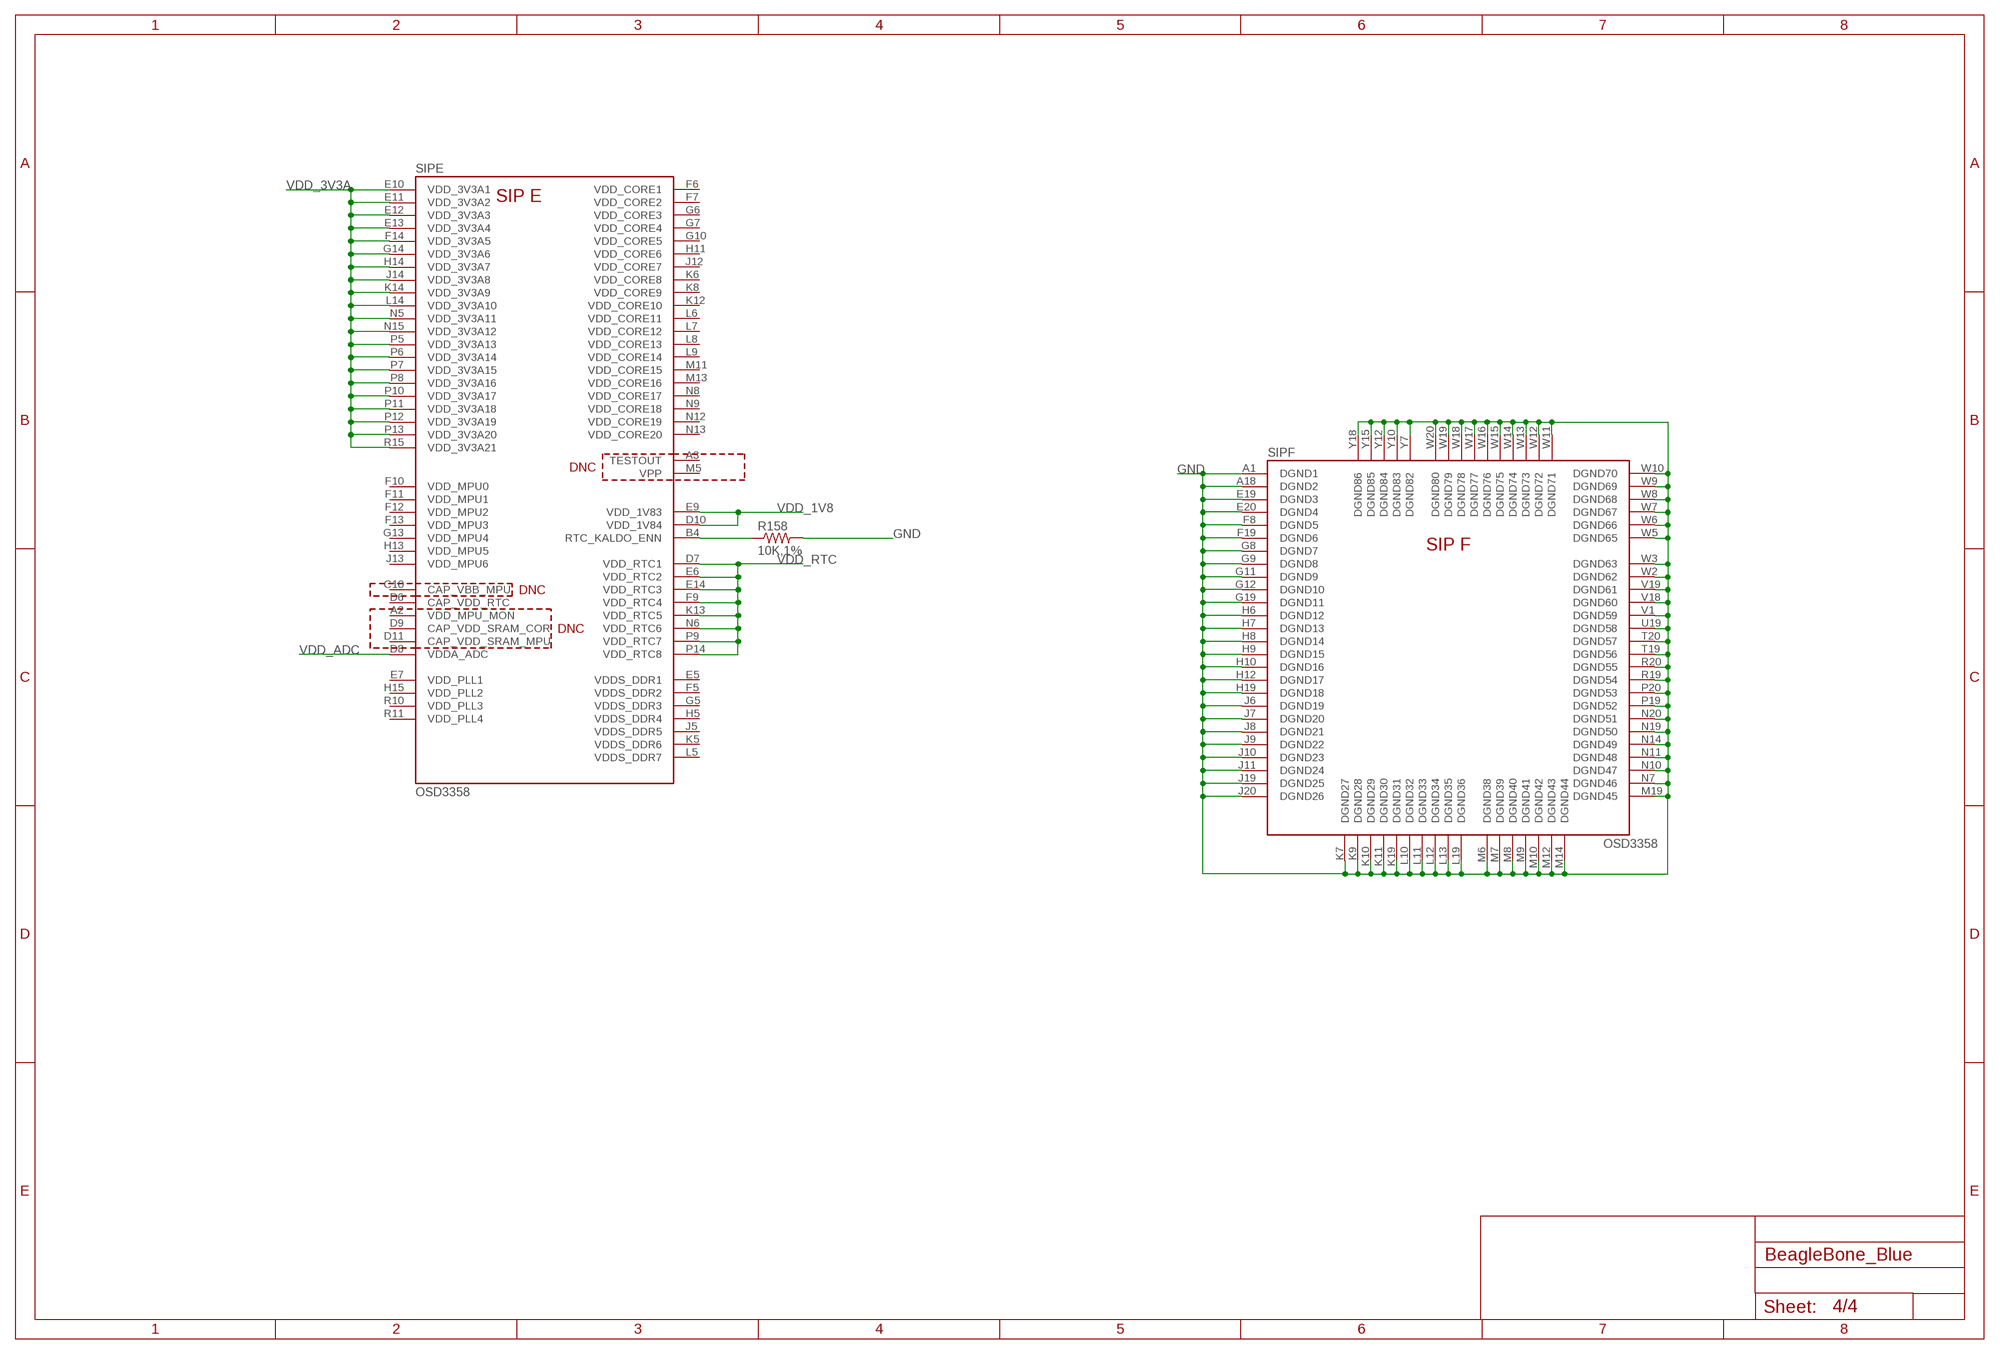
[diagram p3: schematic, sheet 4]

### Parts
R158  10K,1%  RESISTOR0402-RES  [0402-RES]

### Nets
GND: R158.2 SIP.A1(F:DGND1) SIP.A18(F:DGND2) SIP.E19(F:DGND3) SIP.E20(F:DGND4) SIP.F8(F:DGND5) SIP.F19(F:DGND6) SIP.G8(F:DGND7) SIP.G9(F:DGND8) SIP.G11(F:DGND9) SIP.G12(F:DGND10) SIP.G19(F:DGND11) SIP.H6(F:DGND12) SIP.H7(F:DGND13) SIP.H8(F:DGND14) SIP.H9(F:DGND15) SIP.H10(F:DGND16) SIP.H12(F:DGND17) SIP.H19(F:DGND18) SIP.J6(F:DGND19) SIP.J7(F:DGND20) SIP.J8(F:DGND21) SIP.J9(F:DGND22) SIP.J10(F:DGND23) SIP.J11(F:DGND24) SIP.J19(F:DGND25) SIP.J20(F:DGND26) SIP.K7(F:DGND27) SIP.K9(F:DGND28) SIP.K10(F:DGND29) SIP.K11(F:DGND30) SIP.K19(F:DGND31) SIP.L10(F:DGND32) SIP.L11(F:DGND33) SIP.L12(F:DGND34) SIP.L13(F:DGND35) SIP.L19(F:DGND36) SIP.M6(F:DGND38) SIP.M7(F:DGND39) SIP.M8(F:DGND40) SIP.M9(F:DGND41) SIP.M10(F:DGND42) SIP.M12(F:DGND43) SIP.M14(F:DGND44) SIP.M19(F:DGND45) SIP.N7(F:DGND46) SIP.N10(F:DGND47) SIP.N11(F:DGND48) SIP.N14(F:DGND49) SIP.N19(F:DGND50) SIP.N20(F:DGND51) SIP.P19(F:DGND52) SIP.P20(F:DGND53) SIP.R19(F:DGND54) SIP.R20(F:DGND55) SIP.T19(F:DGND56) SIP.T20(F:DGND57) SIP.U19(F:DGND58) SIP.V1(F:DGND59) SIP.V18(F:DGND60) SIP.V19(F:DGND61) SIP.W2(F:DGND62) SIP.W3(F:DGND63) SIP.W5(F:DGND65) SIP.W6(F:DGND66) SIP.W7(F:DGND67) SIP.W8(F:DGND68) SIP.W9(F:DGND69) SIP.W10(F:DGND70) SIP.W11(F:DGND71) SIP.W12(F:DGND72) SIP.W13(F:DGND73) SIP.W14(F:DGND74) SIP.W15(F:DGND75) SIP.W16(F:DGND76) SIP.W17(F:DGND77) SIP.W18(F:DGND78) SIP.W19(F:DGND79) SIP.W20(F:DGND80) SIP.Y7(F:DGND82) SIP.Y10(F:DGND83) SIP.Y12(F:DGND84) SIP.Y15(F:DGND85) SIP.Y18(F:DGND86) ; also sheet 1,2,3
N$131: R158.1 SIP.B4(E:RTC_KALDO_ENN)
VDD_1V8: SIP.D10(E:VDD_1V84) SIP.E9(E:VDD_1V83) ; also sheet 2
VDD_3V3A: SIP.E10(E:VDD_3V3A1) SIP.E11(E:VDD_3V3A2) SIP.E12(E:VDD_3V3A3) SIP.E13(E:VDD_3V3A4) SIP.F14(E:VDD_3V3A5) SIP.G14(E:VDD_3V3A6) SIP.H14(E:VDD_3V3A7) SIP.J14(E:VDD_3V3A8) SIP.K14(E:VDD_3V3A9) SIP.L14(E:VDD_3V3A10) SIP.N5(E:VDD_3V3A11) SIP.N15(E:VDD_3V3A12) SIP.P5(E:VDD_3V3A13) SIP.P6(E:VDD_3V3A14) SIP.P7(E:VDD_3V3A15) SIP.P8(E:VDD_3V3A16) SIP.P10(E:VDD_3V3A17) SIP.P11(E:VDD_3V3A18) SIP.P12(E:VDD_3V3A19) SIP.P13(E:VDD_3V3A20) SIP.R15(E:VDD_3V3A21) ; also sheet 2,3
VDD_ADC: SIP.D8(E:VDDA_ADC) ; also sheet 1,3
VDD_RTC: SIP.D7(E:VDD_RTC1) SIP.E6(E:VDD_RTC2) SIP.E14(E:VDD_RTC3) SIP.F9(E:VDD_RTC4) SIP.K13(E:VDD_RTC5) SIP.N6(E:VDD_RTC6) SIP.P9(E:VDD_RTC7) SIP.P14(E:VDD_RTC8) ; also sheet 2
Unconnected: SIP.A2(E:VDD_MPU_MON) SIP.A3(E:TESTOUT) SIP.C10(E:CAP_VBB_MPU) SIP.D6(E:CAP_VDD_RTC) SIP.D9(E:CAP_VDD_SRAM_COR) SIP.D11(E:CAP_VDD_SRAM_MPU) SIP.E5(E:VDDS_DDR1) SIP.E7(E:VDD_PLL1) SIP.F5(E:VDDS_DDR2) SIP.F6(E:VDD_CORE1) SIP.F7(E:VDD_CORE2) SIP.F10(E:VDD_MPU0) SIP.F11(E:VDD_MPU1) SIP.F12(E:VDD_MPU2) SIP.F13(E:VDD_MPU3) SIP.G5(E:VDDS_DDR3) SIP.G6(E:VDD_CORE3) SIP.G7(E:VDD_CORE4) SIP.G10(E:VDD_CORE5) SIP.G13(E:VDD_MPU4) SIP.H5(E:VDDS_DDR4) SIP.H11(E:VDD_CORE6) SIP.H13(E:VDD_MPU5) SIP.H15(E:VDD_PLL2) SIP.J5(E:VDDS_DDR5) SIP.J12(E:VDD_CORE7) SIP.J13(E:VDD_MPU6) SIP.K5(E:VDDS_DDR6) SIP.K6(E:VDD_CORE8) SIP.K8(E:VDD_CORE9) SIP.K12(E:VDD_CORE10) SIP.L5(E:VDDS_DDR7) SIP.L6(E:VDD_CORE11) SIP.L7(E:VDD_CORE12) SIP.L8(E:VDD_CORE13) SIP.L9(E:VDD_CORE14) SIP.M5(E:VPP) SIP.M11(E:VDD_CORE15) SIP.M13(E:VDD_CORE16) SIP.N8(E:VDD_CORE17) SIP.N9(E:VDD_CORE18) SIP.N12(E:VDD_CORE19) SIP.N13(E:VDD_CORE20) SIP.R10(E:VDD_PLL3) SIP.R11(E:VDD_PLL4)

## Library data of the parts
5VREG = BeagleBone_Blue:AP1509: 150KHz, 2A PWM BUCK DC/DC CONVERTER
6V_REG = Strawson_Eagle_Lib:AOZ1284
ADC GPS SPI1.1 SPI1.2 = Strawson_Eagle_Lib:JST_SH_6
BAL = Strawson_Eagle_Lib:BQ29209: BQ29209 2-CELL Balance and Overvoltage Protection
BMP = SparkFun-Sensors:BMP180: BOSCH BMP180 DIGITAL BAROMETRIC PRESSURE SENSOR Web page: http://www.bosch-sensortec.com/en/homepage/products_3/environmental_sensors_1/bmp180_1/bmp180 Datasheet: http://ae-bst.resource.bosch.com/media/products/dokumente/bmp180/BST-BMP180-DS000-09.pdf The BMP180 is the function compatible successor of the BMP085, a new generation of high precision digital pressure sensors for consumer applications. The ultra-low power, low voltage electronics of the BMP180 is optimized for use in mobile phones, PDAs, GPS navigation devices and outdoor equipment. With a low altitude noise of merely 0.25m at fast conversion time, the BMP180 offers superior performance. The I2C interface allows for easy system integration with a microcontroller. The BMP180 is based on piezo-resistive technology for EMC robustness, high accuracy and linearity as well as long term stability. Key features: - Temperature measurement included - I2C interface - Fully calibrated - Pb-free, halogen-free and RoHS compliant, - MSL 1 Basic specs: Pressure range: 300 to 1100hPa (+9000m to -500m relating to sea level) Supply voltage: 1.8 to 3.6V (VDD), 1.62V to 3.6V (VDDIO) Package: LGA package with metal lid Small footprint: 3.6mm x 3.8mm Super-flat: 0.93mm height Low power: 5μA at 1 sample / sec. in standard mode Low noise: 0.06hPa (0.5m) in ultra low power mode, 0.02hPa (0.17m) advanced resolution mode Typical applications: - Enhancement of GPS navigation (dead-reckoning, slope detection, etc.) - In- and out-door navigation - Leisure and sports - Weather forecast - Vertical velocity indication (rise/sink speed)
BOOT MODE PAUSE POWER RESET = SparkFun-Electromechanical:SWITCH-MOMENTARY-2: Various NO switches- pushbuttons, reed, etc; PROD_ID: SWCH-00815
C1 C2 C4 C6 C8-C10 C13-C15 C17-C19 C21 C22 C24 C27-C46 = Strawson_Eagle_Lib:CAP: Capacitor Standard 0603 ceramic capacitor, and 0.1" leaded capacitor.
C3 C5 C7 C12 C16 C20 C23 C25 C26 = SparkFun-Capacitors:CAP: Capacitor Standard 0603 ceramic capacitor, and 0.1" leaded capacitor.
C11 = adafruit:CPOL-US: POLARIZED CAPACITOR, American symbol
C50 = BeagleBone_Blue:AVE107M06D16T-F
CHG D4-D7 GRN RED = SparkFun-LED:LED: LEDs Standard schematic elements and footprints for 5mm, 3mm, 1206, and 0603 sized LEDs. 5mm - Spark Fun Electronics SKU : COM-00529 (and others)
CHGIC = Strawson_Eagle_Lib:MP2615
D1-D3 = adafruit:DIODE: Diode
D8 D10-D13 = BeagleBone_Blue:LED: LEDs Standard schematic elements and footprints for 5mm, 3mm, 1206, and 0603 sized LEDs. 5mm - Spark Fun Electronics SKU : COM-00529 (and others)
D9 = Strawson_Eagle_Lib:DIODE: Diode
DSM2 = Strawson_Eagle_Lib:JST_ZH_3
E1-E4 I2C1 PWR UART0 UART1 UART5 = Strawson_Eagle_Lib:JST_SH_4
H1 H2 = SparkFun:TB6621FNG: Toshiba 1A motor driver
HOST = BeagleBone_Blue:87520-0010BLF
IMU = Strawson_Eagle_Lib:MPU-9250: 314990005; MPN: MPU-9250
JACK = con-jack:DCJ0303: DC POWER JACK Source: DCJ0303.pdf; OC_FARNELL: unknown; OC_NEWARK: unknown
L1 L2 = SparkFun-Passives:INDUCTOR: Inductors; PROD_ID: NDUC-11627; VALUE: 33uH
L3 = Strawson_Eagle_Lib:INDUCTOR: Inductors; VALUE: 3.3uH
L4 L5 = Seeed-OPL-Inductor:INDUCTOR/FERRITE-BEAD
LIPO = Strawson_Eagle_Lib:JST_XH_3-PIN
M1-M4 = Strawson_Eagle_Lib:JST_ZH_2
P10 = SCHA5B0200:SCHA5B0200
PROT = Strawson_Eagle_Lib:S-8261
Q3 = Strawson_Eagle_Lib:MOSFET-NCHANNEL: Common NMOSFET Parts MFG P/N Store ID Prod ID FDD8780 TRANS-09984 SI7820DN TRANS-11055 FDS6630A IC-08089 2N7002PW TRANS-11151 FQP30N06L COM-10213 TRANS-10060 BSS123LT1G TRANS-08345 BSS138 TRANS-00830 BS170 2N7000
R1-R3 R5-R111 R113 R115 R116 R118 R120 R122 R125 R127 R129 R131 R133 R135 R137 R139 R140 R143-R158 = Strawson_Eagle_Lib:RESISTOR: Resistor Basic schematic elements and footprints for 0603, 1206, and PTH resistors.
R4 = SparkFun-Resistors:RESISTOR: Resistor Basic schematic elements and footprints for 0603, 1206, and PTH resistors.
SIP = BeagleBone_Blue:OSD3358: Octavo Systems LLC - OSD3358 Rev A
TP1-TP20 = testpad:TPSQ: Test pad
U1 U4 = BeagleBone_Blue:TPD4S012_DRY_6; DATASHEETURL: http://www.ti.com/lit/gpn/TPD4S012; DESCRIPTION: 4-Channel USB ESD Solution with Power Clamp; FAMILY_NAME: ESD Solution; GENERIC_PART_NUMBER: TPD4S012; INDUSTRY_STD_PKG_TYPE: SON; MANUFACTURER: Texas Instruments; MANUFACTURER_PART_NUMBER: tpd4s012_dry_6; PACKAGE_DESIGNATOR: DRY; PIN_COUNT: 6; VENDOR: Texas Instruments
U5 = Microchip-24LCxxx:24LC_: IC, I2C Serial EEPROM,SOT-23-5; MPN: 24LC32AT-I/OT; OC_FARNELL: 1700993; OC_NEWARK: 08P0113; PACKAGE: SOT-23-5; SUPPLIER: MICROCHIP
U6 = BeagleBone_Blue:SN74LVC1G07_DCK_5; DATASHEETURL: http://www.ti.com/lit/gpn/SN74LVC1G07; DESCRIPTION: Single Buffer/Driver With Open-Drain Output; FAMILY_NAME: LL BUFFER AND DRIVER WITH OPEN-DRAIN OUTPUT; GENERIC_PART_NUMBER: SN74LVC1G07; INDUSTRY_STD_PKG_TYPE: SC70; MANUFACTURER: Texas Instruments; MANUFACTURER_PART_NUMBER: sn74lvc1g07_dck_5; PACKAGE_DESIGNATOR: DCK; PIN_COUNT: 5; VENDOR: Texas Instruments
U7 = BeagleBone_Blue:TPS2051B_D_8; DATASHEETURL: http://www.ti.com/lit/gpn/TPS2051B; DESCRIPTION: Single, Current-Limited, Power-Distribution Switch; FAMILY_NAME: USB POWER SWITCH; GENERIC_PART_NUMBER: TPS2051B; INDUSTRY_STD_PKG_TYPE: SOIC; MANUFACTURER: Texas Instruments; MANUFACTURER_PART_NUMBER: tps2051b_d_8; PACKAGE_DESIGNATOR: D; PIN_COUNT: 8; VENDOR: Texas Instruments
U8 = BeagleBone_Blue:MTFC4GLDEA
U$1 = Strawson_Eagle_Lib:SERVO_HEADERS_8X
USB = Strawson_Eagle_Lib:USB-AB: This is a USB AB connector that is compatible with USB OTG. i.e. this connector can serve as a host or device
Y1 = CM200C-32.768KAZF-UT:CM200C-32.768KAZF-UT
Y2 = 445C33D24M00000:445C33D24M00000